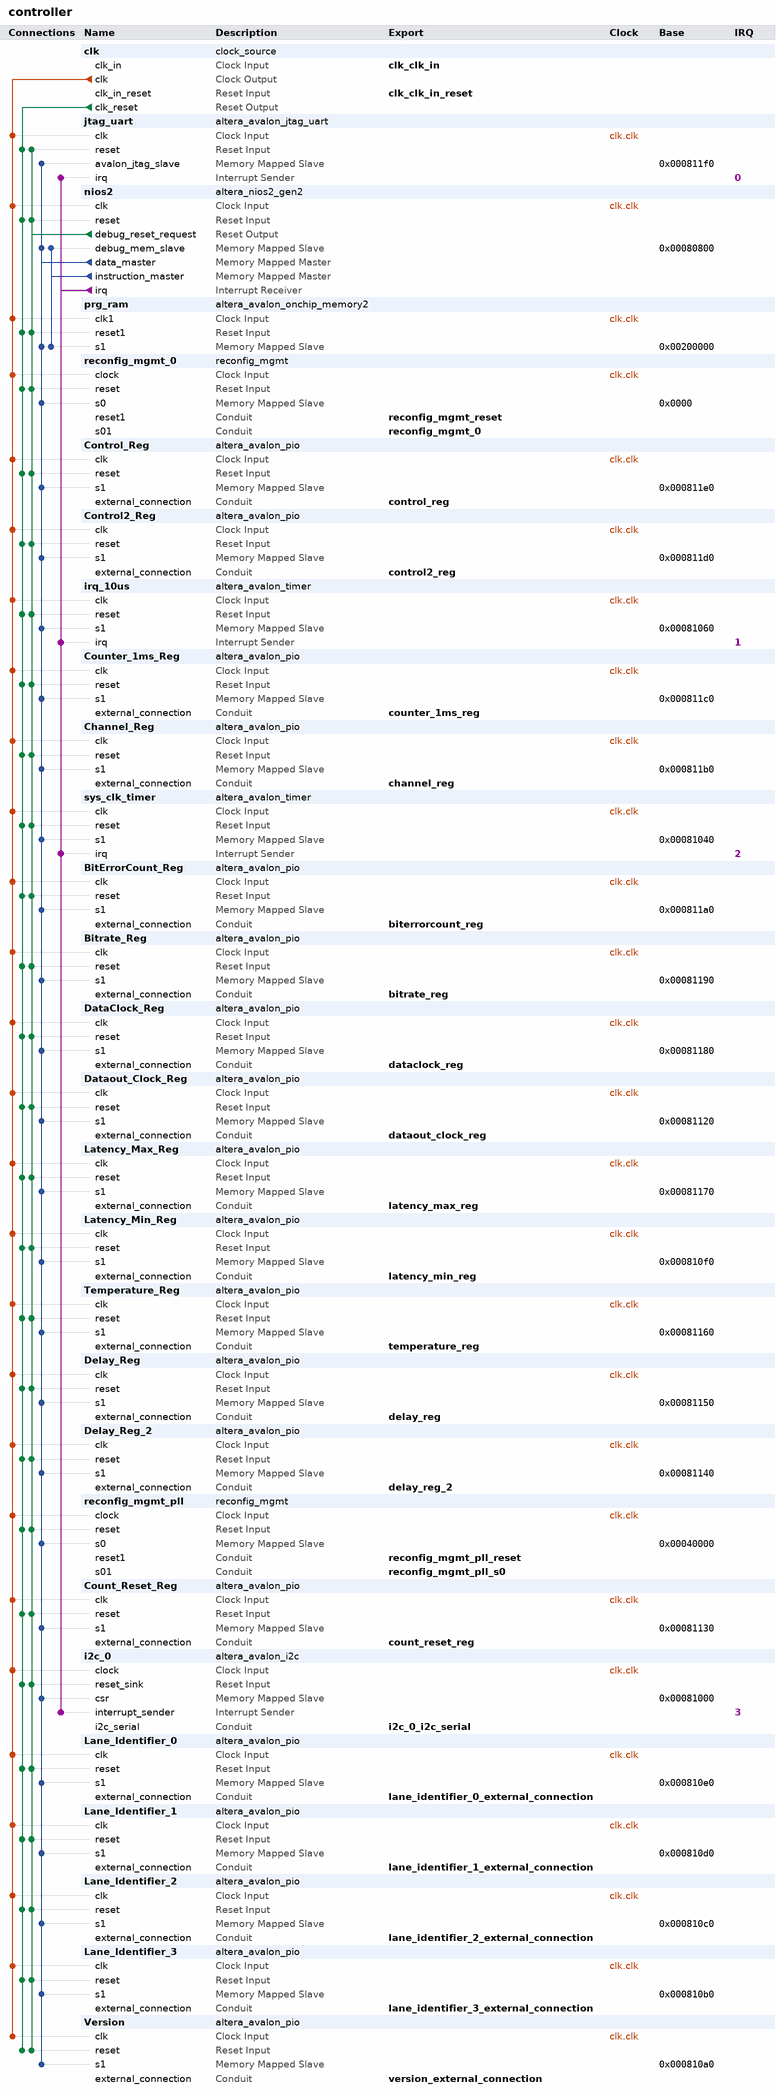
[diagram p0: system contents]
# Platform Designer (Qsys) system controller, Arria 10 10AXF40AA
# Parameters at their usual value, and those the tool derives, are not listed.
package require -exact qsys 20.1
create_system controller
set_project_property DEVICE_FAMILY {Arria 10}
set_project_property DEVICE 10AXF40AA

add_instance clk clock_source 20.1
set_instance_parameter_value clk clockFrequency 100000000

add_instance jtag_uart altera_avalon_jtag_uart 20.1
set_instance_parameter_value jtag_uart simInteractiveOptions INTERACTIVE_INPUT_OUTPUT

add_instance nios2 altera_nios2_gen2 20.1
set_instance_parameter_value nios2 dcache_size 4096
set_instance_parameter_value nios2 exceptionSlave prg_ram.s1
set_instance_parameter_value nios2 icache_size 4096
set_instance_parameter_value nios2 impl Fast
set_instance_parameter_value nios2 mmu_processIDNumBits 10
set_instance_parameter_value nios2 resetSlave prg_ram.s1
set_instance_parameter_value nios2 setting_activateTrace true
set_instance_parameter_value nios2 setting_preciseIllegalMemAccessException true

add_instance prg_ram altera_avalon_onchip_memory2 20.1
set_instance_parameter_value prg_ram dataWidth 32
set_instance_parameter_value prg_ram dualPort false
set_instance_parameter_value prg_ram initMemContent false
set_instance_parameter_value prg_ram initializationFileName prg_ram
set_instance_parameter_value prg_ram memorySize 1048576

add_instance reconfig_mgmt_0 reconfig_mgmt 1.0

add_instance Control_Reg altera_avalon_pio 20.1
set_instance_parameter_value Control_Reg direction Output
set_instance_parameter_value Control_Reg width 16

add_instance Control2_Reg altera_avalon_pio 20.1
set_instance_parameter_value Control2_Reg direction Output
set_instance_parameter_value Control2_Reg width 16

add_instance irq_10us altera_avalon_timer 20.1
set_instance_parameter_value irq_10us period 10.0
set_instance_parameter_value irq_10us periodUnits USEC

add_instance Counter_1ms_Reg altera_avalon_pio 20.1
set_instance_parameter_value Counter_1ms_Reg captureEdge true
set_instance_parameter_value Counter_1ms_Reg direction Input
set_instance_parameter_value Counter_1ms_Reg width 32

add_instance Channel_Reg altera_avalon_pio 20.1
set_instance_parameter_value Channel_Reg captureEdge true
set_instance_parameter_value Channel_Reg direction Input
set_instance_parameter_value Channel_Reg width 32

add_instance sys_clk_timer altera_avalon_timer 20.1
set_instance_parameter_value sys_clk_timer period 1.0
set_instance_parameter_value sys_clk_timer periodUnits MSEC

add_instance BitErrorCount_Reg altera_avalon_pio 20.1
set_instance_parameter_value BitErrorCount_Reg captureEdge true
set_instance_parameter_value BitErrorCount_Reg direction Input
set_instance_parameter_value BitErrorCount_Reg width 16

add_instance Bitrate_Reg altera_avalon_pio 20.1
set_instance_parameter_value Bitrate_Reg captureEdge true
set_instance_parameter_value Bitrate_Reg direction Input
set_instance_parameter_value Bitrate_Reg width 32

add_instance DataClock_Reg altera_avalon_pio 20.1
set_instance_parameter_value DataClock_Reg captureEdge true
set_instance_parameter_value DataClock_Reg direction Input
set_instance_parameter_value DataClock_Reg width 32

add_instance Dataout_Clock_Reg altera_avalon_pio 20.1
set_instance_parameter_value Dataout_Clock_Reg captureEdge true
set_instance_parameter_value Dataout_Clock_Reg direction Input
set_instance_parameter_value Dataout_Clock_Reg width 32

add_instance Latency_Max_Reg altera_avalon_pio 20.1
set_instance_parameter_value Latency_Max_Reg captureEdge true
set_instance_parameter_value Latency_Max_Reg direction Input
set_instance_parameter_value Latency_Max_Reg width 8

add_instance Latency_Min_Reg altera_avalon_pio 20.1
set_instance_parameter_value Latency_Min_Reg captureEdge true
set_instance_parameter_value Latency_Min_Reg direction Input
set_instance_parameter_value Latency_Min_Reg width 8

add_instance Temperature_Reg altera_avalon_pio 20.1
set_instance_parameter_value Temperature_Reg captureEdge true
set_instance_parameter_value Temperature_Reg direction Input
set_instance_parameter_value Temperature_Reg width 8

add_instance Delay_Reg altera_avalon_pio 20.1
set_instance_parameter_value Delay_Reg captureEdge true
set_instance_parameter_value Delay_Reg direction Input
set_instance_parameter_value Delay_Reg width 32

add_instance Delay_Reg_2 altera_avalon_pio 20.1
set_instance_parameter_value Delay_Reg_2 captureEdge true
set_instance_parameter_value Delay_Reg_2 direction Input
set_instance_parameter_value Delay_Reg_2 width 32

add_instance reconfig_mgmt_pll reconfig_mgmt 1.0

add_instance Count_Reset_Reg altera_avalon_pio 20.1
set_instance_parameter_value Count_Reset_Reg captureEdge true
set_instance_parameter_value Count_Reset_Reg direction Input
set_instance_parameter_value Count_Reset_Reg width 32

add_instance i2c_0 altera_avalon_i2c 20.1
set_instance_parameter_value i2c_0 FIFO_DEPTH 4

add_instance Lane_Identifier_0 altera_avalon_pio 20.1
set_instance_parameter_value Lane_Identifier_0 captureEdge true
set_instance_parameter_value Lane_Identifier_0 direction Input
set_instance_parameter_value Lane_Identifier_0 width 8

add_instance Lane_Identifier_1 altera_avalon_pio 20.1
set_instance_parameter_value Lane_Identifier_1 captureEdge true
set_instance_parameter_value Lane_Identifier_1 direction Input
set_instance_parameter_value Lane_Identifier_1 width 8

add_instance Lane_Identifier_2 altera_avalon_pio 20.1
set_instance_parameter_value Lane_Identifier_2 captureEdge true
set_instance_parameter_value Lane_Identifier_2 direction Input
set_instance_parameter_value Lane_Identifier_2 width 8

add_instance Lane_Identifier_3 altera_avalon_pio 20.1
set_instance_parameter_value Lane_Identifier_3 captureEdge true
set_instance_parameter_value Lane_Identifier_3 direction Input
set_instance_parameter_value Lane_Identifier_3 width 8

add_instance Version altera_avalon_pio 20.1
set_instance_parameter_value Version captureEdge true
set_instance_parameter_value Version direction Input
set_instance_parameter_value Version width 32

# connections
add_connection clk.clk BitErrorCount_Reg.clk clock
add_connection clk.clk Bitrate_Reg.clk clock
add_connection clk.clk Channel_Reg.clk clock
add_connection clk.clk Control2_Reg.clk clock
add_connection clk.clk Control_Reg.clk clock
add_connection clk.clk Count_Reset_Reg.clk clock
add_connection clk.clk Counter_1ms_Reg.clk clock
add_connection clk.clk DataClock_Reg.clk clock
add_connection clk.clk Dataout_Clock_Reg.clk clock
add_connection clk.clk Delay_Reg.clk clock
add_connection clk.clk Delay_Reg_2.clk clock
add_connection clk.clk i2c_0.clock clock
add_connection clk.clk irq_10us.clk clock
add_connection clk.clk jtag_uart.clk clock
add_connection clk.clk Lane_Identifier_0.clk clock
add_connection clk.clk Lane_Identifier_1.clk clock
add_connection clk.clk Lane_Identifier_2.clk clock
add_connection clk.clk Lane_Identifier_3.clk clock
add_connection clk.clk Latency_Max_Reg.clk clock
add_connection clk.clk Latency_Min_Reg.clk clock
add_connection clk.clk nios2.clk clock
add_connection clk.clk prg_ram.clk1 clock
add_connection clk.clk reconfig_mgmt_0.clock clock
add_connection clk.clk reconfig_mgmt_pll.clock clock
add_connection clk.clk sys_clk_timer.clk clock
add_connection clk.clk Temperature_Reg.clk clock
add_connection clk.clk Version.clk clock
add_connection clk.clk_reset BitErrorCount_Reg.reset reset
add_connection clk.clk_reset Bitrate_Reg.reset reset
add_connection clk.clk_reset Channel_Reg.reset reset
add_connection clk.clk_reset Control2_Reg.reset reset
add_connection clk.clk_reset Control_Reg.reset reset
add_connection clk.clk_reset Count_Reset_Reg.reset reset
add_connection clk.clk_reset Counter_1ms_Reg.reset reset
add_connection clk.clk_reset DataClock_Reg.reset reset
add_connection clk.clk_reset Dataout_Clock_Reg.reset reset
add_connection clk.clk_reset Delay_Reg.reset reset
add_connection clk.clk_reset Delay_Reg_2.reset reset
add_connection clk.clk_reset i2c_0.reset_sink reset
add_connection clk.clk_reset irq_10us.reset reset
add_connection clk.clk_reset jtag_uart.reset reset
add_connection clk.clk_reset Lane_Identifier_0.reset reset
add_connection clk.clk_reset Lane_Identifier_1.reset reset
add_connection clk.clk_reset Lane_Identifier_2.reset reset
add_connection clk.clk_reset Lane_Identifier_3.reset reset
add_connection clk.clk_reset Latency_Max_Reg.reset reset
add_connection clk.clk_reset Latency_Min_Reg.reset reset
add_connection clk.clk_reset nios2.reset reset
add_connection clk.clk_reset prg_ram.reset1 reset
add_connection clk.clk_reset reconfig_mgmt_0.reset reset
add_connection clk.clk_reset reconfig_mgmt_pll.reset reset
add_connection clk.clk_reset sys_clk_timer.reset reset
add_connection clk.clk_reset Temperature_Reg.reset reset
add_connection clk.clk_reset Version.reset reset
add_connection nios2.debug_reset_request BitErrorCount_Reg.reset reset
add_connection nios2.debug_reset_request Bitrate_Reg.reset reset
add_connection nios2.debug_reset_request Channel_Reg.reset reset
add_connection nios2.debug_reset_request Control2_Reg.reset reset
add_connection nios2.debug_reset_request Control_Reg.reset reset
add_connection nios2.debug_reset_request Count_Reset_Reg.reset reset
add_connection nios2.debug_reset_request Counter_1ms_Reg.reset reset
add_connection nios2.debug_reset_request DataClock_Reg.reset reset
add_connection nios2.debug_reset_request Dataout_Clock_Reg.reset reset
add_connection nios2.debug_reset_request Delay_Reg.reset reset
add_connection nios2.debug_reset_request Delay_Reg_2.reset reset
add_connection nios2.debug_reset_request i2c_0.reset_sink reset
add_connection nios2.debug_reset_request irq_10us.reset reset
add_connection nios2.debug_reset_request jtag_uart.reset reset
add_connection nios2.debug_reset_request Lane_Identifier_0.reset reset
add_connection nios2.debug_reset_request Lane_Identifier_1.reset reset
add_connection nios2.debug_reset_request Lane_Identifier_2.reset reset
add_connection nios2.debug_reset_request Lane_Identifier_3.reset reset
add_connection nios2.debug_reset_request Latency_Max_Reg.reset reset
add_connection nios2.debug_reset_request Latency_Min_Reg.reset reset
add_connection nios2.debug_reset_request nios2.reset reset
add_connection nios2.debug_reset_request prg_ram.reset1 reset
add_connection nios2.debug_reset_request reconfig_mgmt_0.reset reset
add_connection nios2.debug_reset_request reconfig_mgmt_pll.reset reset
add_connection nios2.debug_reset_request sys_clk_timer.reset reset
add_connection nios2.debug_reset_request Temperature_Reg.reset reset
add_connection nios2.debug_reset_request Version.reset reset
add_connection nios2.data_master BitErrorCount_Reg.s1 avalon
set_connection_parameter_value nios2.data_master/BitErrorCount_Reg.s1 baseAddress 0x000811a0
add_connection nios2.data_master Bitrate_Reg.s1 avalon
set_connection_parameter_value nios2.data_master/Bitrate_Reg.s1 baseAddress 0x00081190
add_connection nios2.data_master Channel_Reg.s1 avalon
set_connection_parameter_value nios2.data_master/Channel_Reg.s1 baseAddress 0x000811b0
add_connection nios2.data_master Control2_Reg.s1 avalon
set_connection_parameter_value nios2.data_master/Control2_Reg.s1 baseAddress 0x000811d0
add_connection nios2.data_master Control_Reg.s1 avalon
set_connection_parameter_value nios2.data_master/Control_Reg.s1 baseAddress 0x000811e0
add_connection nios2.data_master Count_Reset_Reg.s1 avalon
set_connection_parameter_value nios2.data_master/Count_Reset_Reg.s1 baseAddress 0x00081130
add_connection nios2.data_master Counter_1ms_Reg.s1 avalon
set_connection_parameter_value nios2.data_master/Counter_1ms_Reg.s1 baseAddress 0x000811c0
add_connection nios2.data_master DataClock_Reg.s1 avalon
set_connection_parameter_value nios2.data_master/DataClock_Reg.s1 baseAddress 0x00081180
add_connection nios2.data_master Dataout_Clock_Reg.s1 avalon
set_connection_parameter_value nios2.data_master/Dataout_Clock_Reg.s1 baseAddress 0x00081120
add_connection nios2.data_master Delay_Reg.s1 avalon
set_connection_parameter_value nios2.data_master/Delay_Reg.s1 baseAddress 0x00081150
add_connection nios2.data_master Delay_Reg_2.s1 avalon
set_connection_parameter_value nios2.data_master/Delay_Reg_2.s1 baseAddress 0x00081140
add_connection nios2.data_master i2c_0.csr avalon
set_connection_parameter_value nios2.data_master/i2c_0.csr baseAddress 0x00081000
add_connection nios2.data_master irq_10us.s1 avalon
set_connection_parameter_value nios2.data_master/irq_10us.s1 baseAddress 0x00081060
add_connection nios2.data_master jtag_uart.avalon_jtag_slave avalon
set_connection_parameter_value nios2.data_master/jtag_uart.avalon_jtag_slave baseAddress 0x000811f0
add_connection nios2.data_master Lane_Identifier_0.s1 avalon
set_connection_parameter_value nios2.data_master/Lane_Identifier_0.s1 baseAddress 0x000810e0
add_connection nios2.data_master Lane_Identifier_1.s1 avalon
set_connection_parameter_value nios2.data_master/Lane_Identifier_1.s1 baseAddress 0x000810d0
add_connection nios2.data_master Lane_Identifier_2.s1 avalon
set_connection_parameter_value nios2.data_master/Lane_Identifier_2.s1 baseAddress 0x000810c0
add_connection nios2.data_master Lane_Identifier_3.s1 avalon
set_connection_parameter_value nios2.data_master/Lane_Identifier_3.s1 baseAddress 0x000810b0
add_connection nios2.data_master Latency_Max_Reg.s1 avalon
set_connection_parameter_value nios2.data_master/Latency_Max_Reg.s1 baseAddress 0x00081170
add_connection nios2.data_master Latency_Min_Reg.s1 avalon
set_connection_parameter_value nios2.data_master/Latency_Min_Reg.s1 baseAddress 0x000810f0
add_connection nios2.data_master nios2.debug_mem_slave avalon
set_connection_parameter_value nios2.data_master/nios2.debug_mem_slave baseAddress 0x00080800
add_connection nios2.data_master prg_ram.s1 avalon
set_connection_parameter_value nios2.data_master/prg_ram.s1 baseAddress 0x00200000
add_connection nios2.data_master reconfig_mgmt_0.s0 avalon
set_connection_parameter_value nios2.data_master/reconfig_mgmt_0.s0 baseAddress 0x0000
add_connection nios2.data_master reconfig_mgmt_pll.s0 avalon
set_connection_parameter_value nios2.data_master/reconfig_mgmt_pll.s0 baseAddress 0x00040000
add_connection nios2.data_master sys_clk_timer.s1 avalon
set_connection_parameter_value nios2.data_master/sys_clk_timer.s1 baseAddress 0x00081040
add_connection nios2.data_master Temperature_Reg.s1 avalon
set_connection_parameter_value nios2.data_master/Temperature_Reg.s1 baseAddress 0x00081160
add_connection nios2.data_master Version.s1 avalon
set_connection_parameter_value nios2.data_master/Version.s1 baseAddress 0x000810a0
add_connection nios2.instruction_master nios2.debug_mem_slave avalon
set_connection_parameter_value nios2.instruction_master/nios2.debug_mem_slave baseAddress 0x00080800
add_connection nios2.instruction_master prg_ram.s1 avalon
set_connection_parameter_value nios2.instruction_master/prg_ram.s1 baseAddress 0x00200000
add_connection nios2.irq i2c_0.interrupt_sender interrupt
set_connection_parameter_value nios2.irq/i2c_0.interrupt_sender irqNumber 3
add_connection nios2.irq irq_10us.irq interrupt
set_connection_parameter_value nios2.irq/irq_10us.irq irqNumber 1
add_connection nios2.irq jtag_uart.irq interrupt
set_connection_parameter_value nios2.irq/jtag_uart.irq irqNumber 0
add_connection nios2.irq sys_clk_timer.irq interrupt
set_connection_parameter_value nios2.irq/sys_clk_timer.irq irqNumber 2

# exported interfaces
add_interface biterrorcount_reg conduit end
set_interface_property biterrorcount_reg EXPORT_OF BitErrorCount_Reg.external_connection
add_interface bitrate_reg conduit end
set_interface_property bitrate_reg EXPORT_OF Bitrate_Reg.external_connection
add_interface channel_reg conduit end
set_interface_property channel_reg EXPORT_OF Channel_Reg.external_connection
add_interface clk_clk_in clock sink
set_interface_property clk_clk_in EXPORT_OF clk.clk_in
add_interface clk_clk_in_reset reset sink
set_interface_property clk_clk_in_reset EXPORT_OF clk.clk_in_reset
add_interface control2_reg conduit end
set_interface_property control2_reg EXPORT_OF Control2_Reg.external_connection
add_interface control_reg conduit end
set_interface_property control_reg EXPORT_OF Control_Reg.external_connection
add_interface count_reset_reg conduit end
set_interface_property count_reset_reg EXPORT_OF Count_Reset_Reg.external_connection
add_interface counter_1ms_reg conduit end
set_interface_property counter_1ms_reg EXPORT_OF Counter_1ms_Reg.external_connection
add_interface dataclock_reg conduit end
set_interface_property dataclock_reg EXPORT_OF DataClock_Reg.external_connection
add_interface dataout_clock_reg conduit end
set_interface_property dataout_clock_reg EXPORT_OF Dataout_Clock_Reg.external_connection
add_interface delay_reg conduit end
set_interface_property delay_reg EXPORT_OF Delay_Reg.external_connection
add_interface delay_reg_2 conduit end
set_interface_property delay_reg_2 EXPORT_OF Delay_Reg_2.external_connection
add_interface i2c_0_i2c_serial conduit end
set_interface_property i2c_0_i2c_serial EXPORT_OF i2c_0.i2c_serial
add_interface lane_identifier_0_external_connection conduit end
set_interface_property lane_identifier_0_external_connection EXPORT_OF Lane_Identifier_0.external_connection
add_interface lane_identifier_1_external_connection conduit end
set_interface_property lane_identifier_1_external_connection EXPORT_OF Lane_Identifier_1.external_connection
add_interface lane_identifier_2_external_connection conduit end
set_interface_property lane_identifier_2_external_connection EXPORT_OF Lane_Identifier_2.external_connection
add_interface lane_identifier_3_external_connection conduit end
set_interface_property lane_identifier_3_external_connection EXPORT_OF Lane_Identifier_3.external_connection
add_interface latency_max_reg conduit end
set_interface_property latency_max_reg EXPORT_OF Latency_Max_Reg.external_connection
add_interface latency_min_reg conduit end
set_interface_property latency_min_reg EXPORT_OF Latency_Min_Reg.external_connection
add_interface reconfig_mgmt_0 conduit end
set_interface_property reconfig_mgmt_0 EXPORT_OF reconfig_mgmt_0.s01
add_interface reconfig_mgmt_pll_reset conduit end
set_interface_property reconfig_mgmt_pll_reset EXPORT_OF reconfig_mgmt_pll.reset1
add_interface reconfig_mgmt_pll_s0 conduit end
set_interface_property reconfig_mgmt_pll_s0 EXPORT_OF reconfig_mgmt_pll.s01
add_interface reconfig_mgmt_reset conduit end
set_interface_property reconfig_mgmt_reset EXPORT_OF reconfig_mgmt_0.reset1
add_interface temperature_reg conduit end
set_interface_property temperature_reg EXPORT_OF Temperature_Reg.external_connection
add_interface version_external_connection conduit end
set_interface_property version_external_connection EXPORT_OF Version.external_connection

set_interconnect_requirement {$system} qsys_mm.clockCrossingAdapter HANDSHAKE
set_interconnect_requirement {$system} qsys_mm.maxAdditionalLatency 0

save_system controller.qsys
